# EAGLE design tridev (EAGLE 6.5.0)
AUTHOR: Brad Campbell; REV: A; TITLE: TriDev

## Sheet 1 of 2
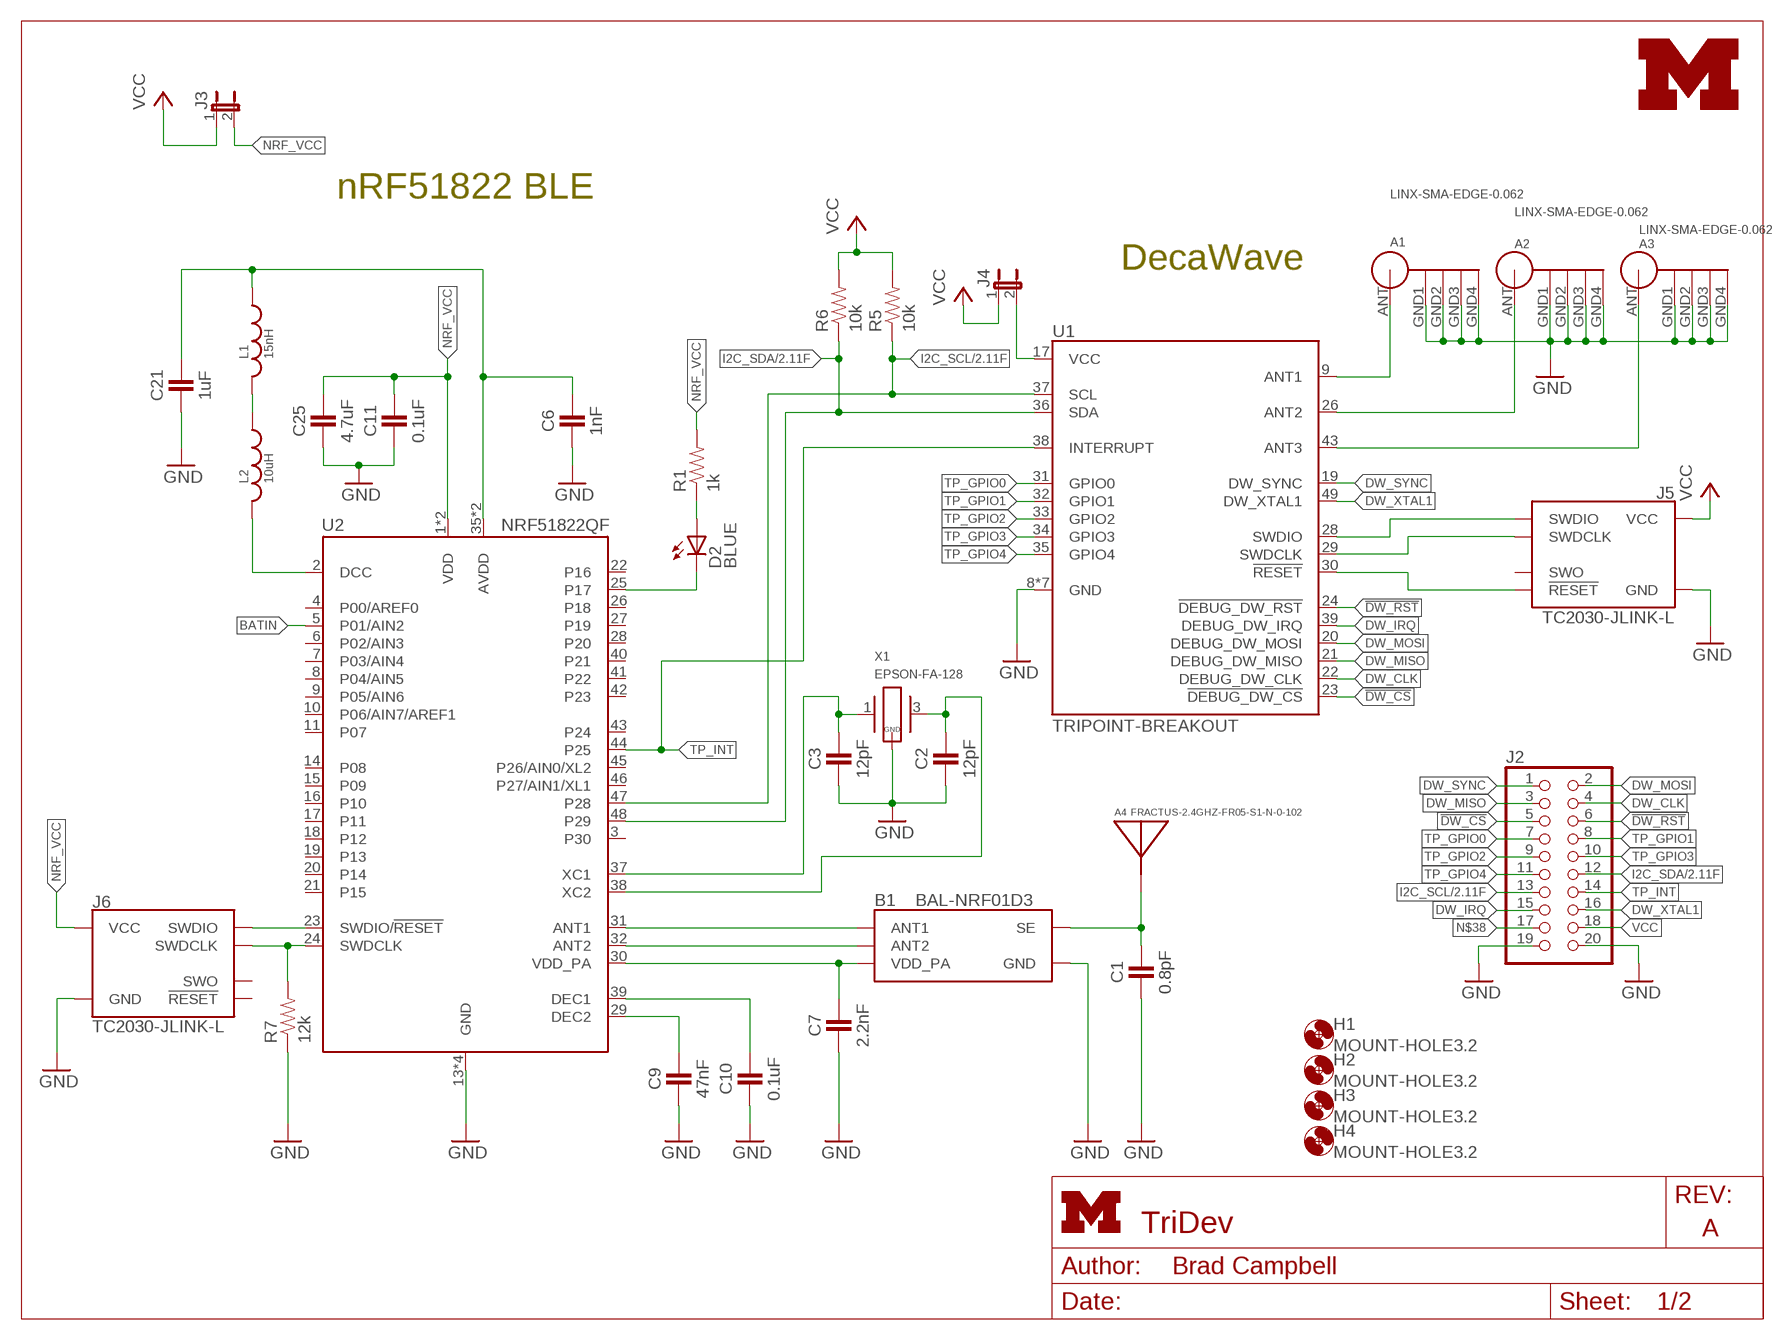
[diagram p0: schematic, sheet 1]
FRAME2 (LETTER_L): HEIGHT: 8.5in; WIDTH: 11in

### Parts
A1  LINX-SMA-EDGE-0.062  [CONSMA003.062]
A2  LINX-SMA-EDGE-0.062  [CONSMA003.062]
A3  LINX-SMA-EDGE-0.062  [CONSMA003.062]
A4  FRACTUS-2.4GHZ-FR05-S1-N-0-102  [FRACTUS-ANTENNA-FR05-S1-N-0-102]
B1  BAL-NRF01D3  [BAL-NRF01D3]
C1  0.8pF  CAPACITOR  [0402_CAP]
C2  12pF  CAPACITOR  [0402_CAP]
C3  12pF  CAPACITOR  [0402_CAP]
C6  1nF  CAPACITOR  [0402_CAP]
C7  2.2nF  CAPACITOR  [0402_CAP]
C9  47nF  CAPACITOR  [0402_CAP]
C10  0.1uF  CAPACITOR  [0402_CAP]
C11  0.1uF  CAPACITOR  [0402_CAP]
C21  1uF  CAPACITOR  [0402_CAP]
C25  4.7uF  CAPACITOR  [0402_CAP]
D2  BLUE  LED0603  [LED-0603]
H1  MOUNT-HOLE3.2  [3,2]
H2  MOUNT-HOLE3.2  [3,2]
H3  MOUNT-HOLE3.2  [3,2]
H4  MOUNT-HOLE3.2  [3,2]
J2  PINHD-2X10  [2X10]
J3  JUMPER-2PTH  [1X02]
J4  JUMPER-2PTH  [1X02]
J5  TC2030-JLINK-L  [TC2030-IDC]
J6  TC2030-JLINK-L  [TC2030-IDC]
L1  15nH  INDUCTOR0402  [0402_CAP]
L2  10uH  INDUCTOR0603  [0603_CAP]
LOGO1  UMICH_SOLID_SMALL  [UMICH_SOLID_75MIL]
R1  1k  RESISTOR0402_RES  [0402_RES]
R5  10k  RESISTOR0402_RES  [0402_RES]
R6  10k  RESISTOR0402_RES  [0402_RES]
R7  12k  RESISTOR0402_RES  [0402_RES]
U1  TRIPOINT-BREAKOUT  [TRIPOINT-BREAKOUT]
U2  NRF51822QF  [QFN-48-6MM]
X1  EPSON-FA-128  [FA-128]

### Nets
!CHRG1: D2.A R1.1
!DW_CS: J2.5 U1.23(!DEBUG_DW_CS)
!DW_RST: J2.6 U1.24(!DEBUG_DW_RST)
ANTENNA: A4.1(ANTENNA) B1.SE C1.1
AVDD: C6.1 C21.1 L1.1 U2.35(AVDD) U2.36(AVDD)
BATIN: U2.5(P01/AIN2)
DCC: L2.2 U2.2(DCC)
DW_CLK: J2.4 U1.22(DEBUG_DW_CLK)
DW_IRQ: J2.15 U1.39(DEBUG_DW_IRQ)
DW_MISO: J2.3 U1.21(DEBUG_DW_MISO)
DW_MOSI: J2.2 U1.20(DEBUG_DW_MOSI)
DW_SYNC: J2.1 U1.19(DW_SYNC)
DW_XTAL1: J2.16 U1.49(DW_XTAL1)
GND: A1.GND1 A1.GND2 A1.GND3 A1.GND4 A2.GND1 A2.GND2 A2.GND3 A2.GND4 A3.GND1 A3.GND2 A3.GND3 A3.GND4 B1.GND C1.2 C2.2 C3.2 C6.2 C7.2 C9.2 C10.2 C11.2 C21.2 C25.2 J2.19 J2.20 J5.5(GND) J6.5(GND) R7.1 U1.8(GND) U1.10(GND) U1.18(GND) U1.25(GND) U1.27(GND) U1.42(GND) U1.44(GND) U2.13(GND) U2.33(GND) U2.34(GND) U2.GND X1.2(GND) X1.4(GND) ; also sheet 2
I2C_SCL: J2.13 R5.1 U1.37(SCL) U2.47(P28) ; also sheet 2
I2C_SDA: J2.12 R6.1 U1.36(SDA) U2.48(P29) ; also sheet 2
N$1: A1.ANT U1.9(ANT1)
N$2: A2.ANT U1.26(ANT2)
N$3: A3.ANT U1.43(ANT3)
N$4: J5.2(SWDIO) U1.28(SWDIO)
N$6: D2.C U2.25(P17)
N$7: J5.4(SWDCLK) U1.29(SWDCLK)
N$8: J5.3(!RESET) U1.30(!RESET)
N$9: C3.1 U2.37(XC1) X1.1
N$10: C2.1 U2.38(XC2) X1.3
N$15: C9.1 U2.29(DEC2)
N$17: C10.1 U2.39(DEC1)
N$18: B1.ANT1 U2.31(ANT1)
N$19: B1.ANT2 U2.32(ANT2)
N$20: B1.VCC(VDD_PA) C7.1 U2.30(VDD_PA)
N$23: J4.2 U1.17(VCC)
N$37: L1.2 L2.1
N$38: J2.17
NRF_VCC: C11.1 C25.1 J3.2 J6.1(VCC) R1.2 U2.1(VDD) U2.12(VDD)
SWDCLK: J6.4(SWDCLK) R7.2 U2.24(SWDCLK)
SWDIO/!RESET: J6.2(SWDIO) U2.23(SWDIO/!RESET)
TP_GPIO0: J2.7 U1.31(GPIO0)
TP_GPIO1: J2.8 U1.32(GPIO1)
TP_GPIO2: J2.9 U1.33(GPIO2)
TP_GPIO3: J2.10 U1.34(GPIO3)
TP_GPIO4: J2.11 U1.35(GPIO4)
TP_INT: J2.14 U1.38(INTERRUPT) U2.44(P25)
VCC: J2.18 J3.1 J4.1 J5.1(VCC) R5.2 R6.2 ; also sheet 2
Unconnected: J5.6(SWO) J6.3(!RESET) J6.6(SWO) U2.3(P30) U2.4(P00/AREF0) U2.6(P02/AIN3) U2.7(P03/AIN4) U2.8(P04/AIN5) U2.9(P05/AIN6) U2.10(P06/AIN7/AREF1) U2.11(P07) U2.14(P08) U2.15(P09) U2.16(P10) U2.17(P11) U2.18(P12) U2.19(P13) U2.20(P14) U2.21(P15) U2.22(P16) U2.26(P18) U2.27(P19) U2.28(P20) U2.40(P21) U2.41(P22) U2.42(P23) U2.43(P24) U2.45(P26/AIN0/XL2) U2.46(P27/AIN1/XL1)

### Notes on the sheet
- nRF51822 BLE
- DecaWave

## Sheet 2 of 2
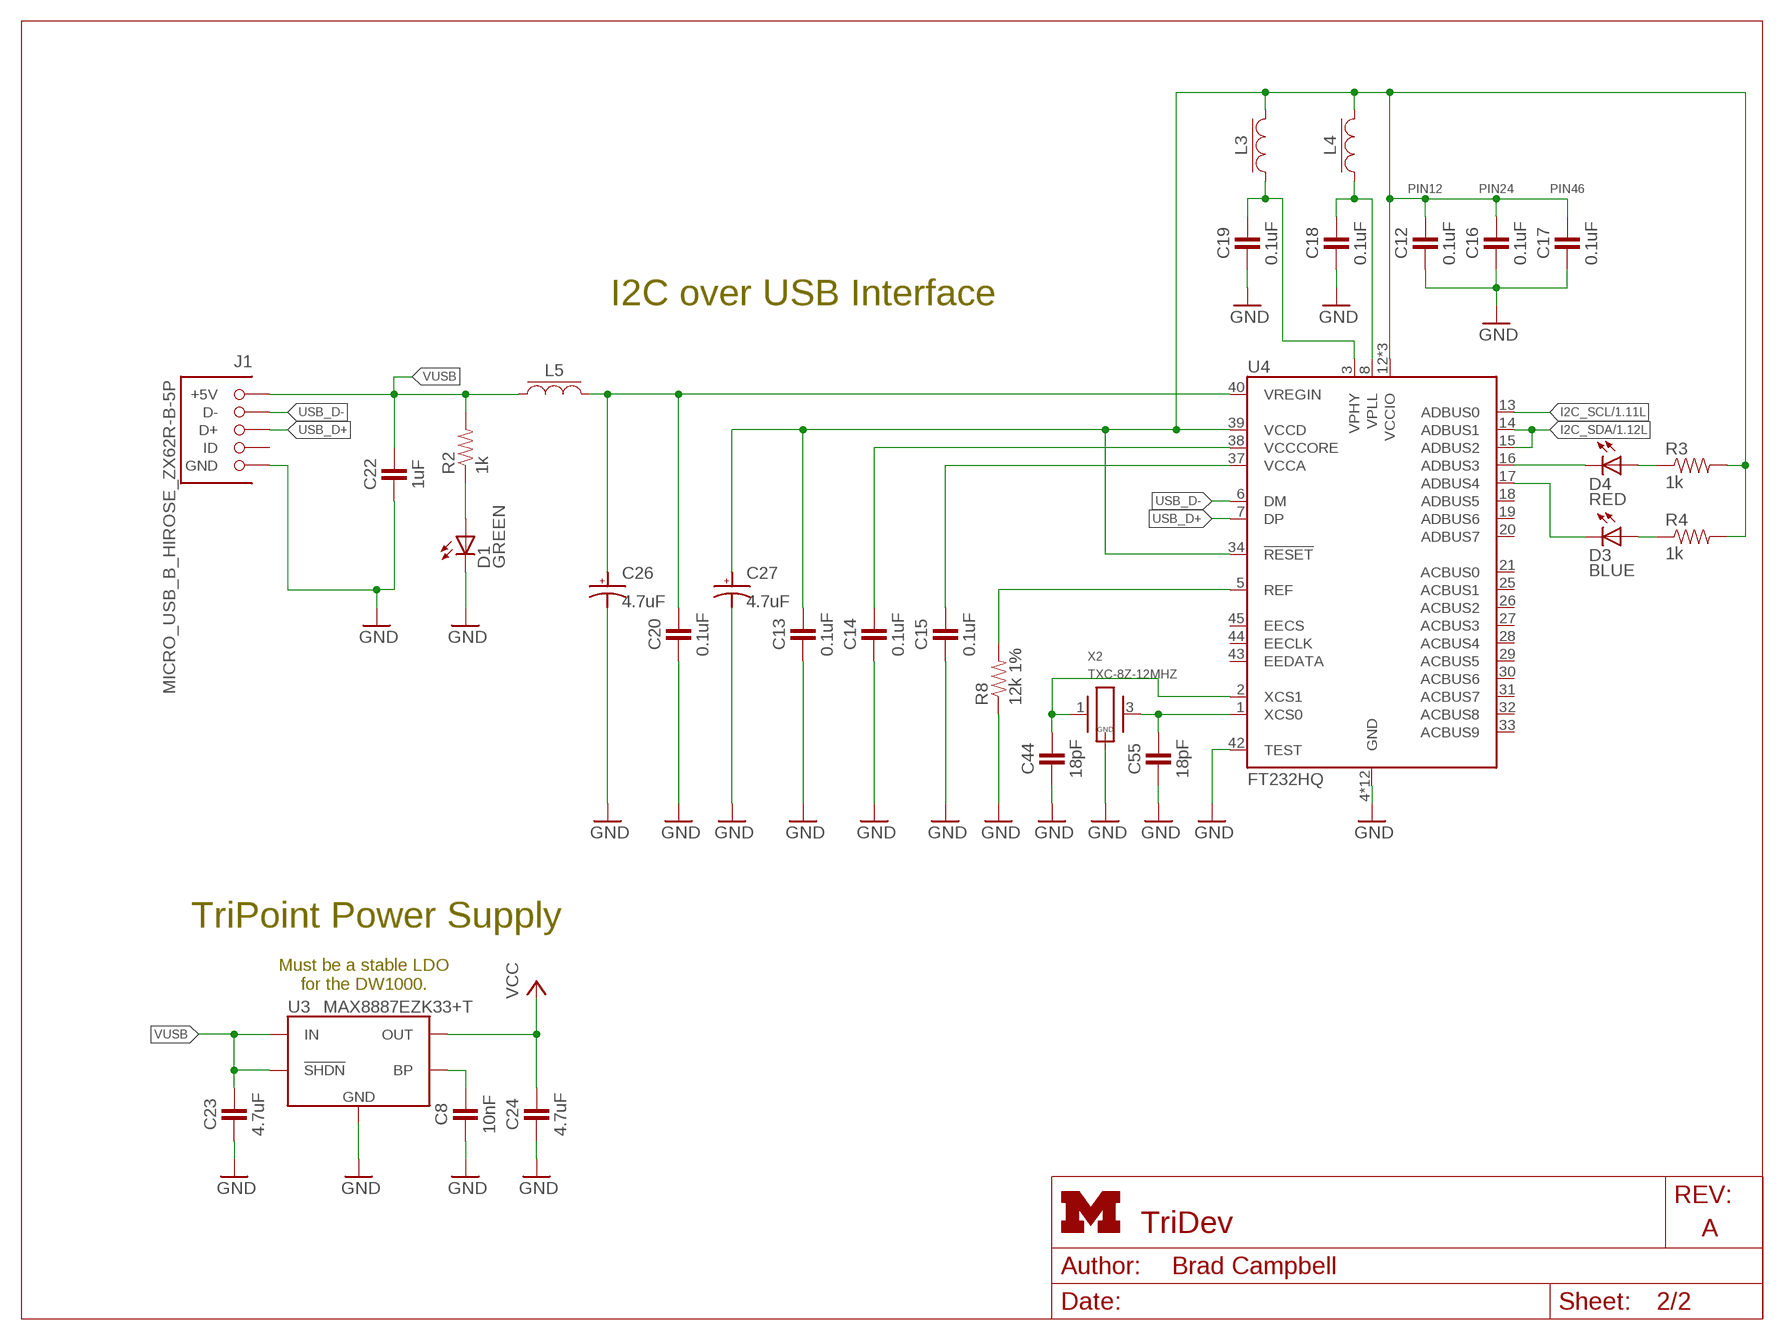
[diagram p1: schematic, sheet 2]
FRAME1 (LETTER_L): HEIGHT: 8.5in; WIDTH: 11in

### Parts
C8  10nF  CAPACITOR  [0402_CAP]
C12  0.1uF  CAPACITOR  [0402_CAP]
C13  0.1uF  CAPACITOR  [0402_CAP]
C14  0.1uF  CAPACITOR  [0402_CAP]
C15  0.1uF  CAPACITOR  [0402_CAP]
C16  0.1uF  CAPACITOR  [0402_CAP]
C17  0.1uF  CAPACITOR  [0402_CAP]
C18  0.1uF  CAPACITOR  [0402_CAP]
C19  0.1uF  CAPACITOR  [0402_CAP]
C20  0.1uF  CAPACITOR  [0402_CAP]
C22  1uF  CAPACITOR  [0402_CAP]
C23  4.7uF  CAPACITOR  [0402_CAP]
C24  4.7uF  CAPACITOR  [0402_CAP]
C26  4.7uF  CAP_POL0603  [CAP0603]
C27  4.7uF  CAP_POL0603  [CAP0603]
C44  18pF  CAPACITOR  [0402_CAP]
C55  18pF  CAPACITOR  [0402_CAP]
D1  GREEN  LED0603  [LED-0603]
D3  BLUE  LED0603  [LED-0603]
D4  RED  LED0603  [LED-0603]
J1  MICRO_USB_B_HIROSE_ZX62R-B-5P  [USB_MICRO_B-HIROSE-ZX62R-B-5P]
L3  FERRITE_BEAD  [0603_CAP]
L4  FERRITE_BEAD  [0603_CAP]
L5  FERRITE_BEAD  [0603_CAP]
R2  1k  RESISTOR0402_RES  [0402_RES]
R3  1k  RESISTOR0402_RES  [0402_RES]
R4  1k  RESISTOR0402_RES  [0402_RES]
R8  12k 1%  RESISTOR0402_RES  [0402_RES]
U3  MAX8887EZK33+T  [SOT-23-5]
U4  FT232HQ  [QFN-48-8MM]
X2  TXC-8Z-12MHZ  [TXC-8Z]

### Nets
!CHRG: D1.A R2.1
GND: C8.2 C12.2 C13.2 C14.2 C15.2 C16.2 C17.2 C18.2 C19.2 C20.2 C22.2 C23.2 C24.2 C26.NEG(ANODE) C27.NEG(ANODE) C44.2 C55.2 D1.C J1.5(GND) R8.1 U3.2(GND) U4.4(GND) U4.9(GND) U4.10(GND) U4.11(GND) U4.22(GND) U4.23(GND) U4.35(GND) U4.36(GND) U4.41(GND) U4.42(TEST) U4.47(GND) U4.48(GND) U4.PAD(GND) X2.2(GND) X2.4(GND) ; also sheet 1
I2C_SCL: U4.13(ADBUS0) ; also sheet 1
I2C_SDA: U4.14(ADBUS1) U4.15(ADBUS2) ; also sheet 1
N$5: D4.C U4.16(ADBUS3)
N$11: C8.1 U3.4(BP)
N$12: C20.1 C26.POS(CATHODE) L5.2 U4.40(VREGIN)
N$13: C14.1 U4.38(VCCCORE)
N$14: C55.1 U4.1(XCS0) X2.3
N$16: C44.1 U4.2(XCS1) X2.1
N$21: C15.1 U4.37(VCCA)
N$22: R8.2 U4.5(REF)
N$24: D4.A R3.1
N$25: D3.A R4.1
N$26: D3.C U4.17(ADBUS4)
USB_D+: J1.3(D+) U4.7(DP)
USB_D-: J1.2(D-) U4.6(DM)
VCC: C24.1 U3.5(OUT) ; also sheet 1
VCC3V3: C12.1 C13.1 C16.1 C17.1 C27.POS(CATHODE) L3.2 L4.2 R3.2 R4.2 U4.12(VCCIO) U4.24(VCCIO) U4.34(!RESET) U4.39(VCCD) U4.46(VCCIO)
VPHY: C19.1 L3.1 U4.3(VPHY)
VPLL: C18.1 L4.1 U4.8(VPLL)
VUSB: C22.1 C23.1 J1.1(+5V) L5.1 R2.2 U3.1(IN) U3.3(!SHDN)
Unconnected: J1.4(ID) U4.18(ADBUS5) U4.19(ADBUS6) U4.20(ADBUS7) U4.21(ACBUS0) U4.25(ACBUS1) U4.26(ACBUS2) U4.27(ACBUS3) U4.28(ACBUS4) U4.29(ACBUS5) U4.30(ACBUS6) U4.31(ACBUS7) U4.32(ACBUS8) U4.33(ACBUS9) U4.43(EEDATA) U4.44(EECLK) U4.45(EECS)

### Notes on the sheet
- PIN12 | PIN24 | PIN46
- I2C over USB Interface
- TriPoint Power Supply
- Must be a stable LDO
  for the DW1000.

## Library data of the parts
A1-A3 = connector:LINX-SMA-EDGE-0.062: CONN SMA JACK 50 OHM EDGE MNT; DIGIKEY: CONSMA003.062-ND
A4 = chips:FRACTUS-2.4GHZ-FR05-S1-N-0-102: Fractus Compact Reach XtendTM chip antenna is engineered specifically for Bluetooth, WLAN 802.11 b/g/n and other wireless devices operating at the ISM 2.4 GHz band. Compact Reach Xtend combines small form factor size and high performance to improve the functionality of your wireless devices.; RICHARDSON_RFPD: FR05-S1-N-0102B
B1 = chips:BAL-NRF01D3: 50 ohm nominal input / conjugate match balun to nRF51422-QFAA, nRF24LE1, nRF51822-QFAA/AB, with integrated harmonic filter; DIGIKEY: 497-13637-1-ND; MOUSER: 511-BAL-NRF01D3
C1-C3 C6-C25 C44 C55 = passives:CAPACITOR: 0402 Capacitor
C26 C27 = passives:CAP_POL; DIGIKEY: 478-8656-1-ND
D1-D4 = SparkFun-LED:LED: LEDs Standard schematic elements and footprints for 5mm, 3mm, 1206, and 0603 sized LEDs. 5mm - Spark Fun Electronics SKU : COM-00529 (and others)
H1-H4 = holes:MOUNT-HOLE: MOUNTING HOLE with drill center marker
J1 = connector:MICRO_USB_B_HIROSE_ZX62R-B-5P: USB Micro B Connector Rounded side is up.; DIGIKEY: H11574CT-ND; MOUSER: 798-ZX62R-B-5P; NEWARK: 69W0714
J2 = pinhead:PINHD-2X10: PIN HEADER
J3 J4 = SparkFun-Passives:JUMPER-2: Jumper Basic 0.1" spaced jumper. Use with breakaway headers.
J5 J6 = connector:TC2030-JLINK
L1 L2 = passives:INDUCTOR
L3-L5 = passives:FERRITE_BEAD; DIGIKEY: 445-2166-1-ND
LOGO1 = logos:UMICH_SOLID
R1-R8 = passives:RESISTOR: Resistor Basic schematic elements and footprints for 0603, 1206, and PTH resistors.
U1 = tripoint:TRIPOINT: UWB Ranging Module
U2 = chips:NRF51822: Multiprotocol Bluetooth® 4.0 low energy/2.4 GHz RF SoC; DIGIKEY: 1490-1032-1-ND; MOUSER: 949-NRF51822-QFAB-R7
U3 = chips:MAX8887: IC REG LDO 3.3V 0.3A TSOT23-5; DIGIKEY: MAX8887EZK33+TCT-ND
U4 = chips:FT232H: Single Channel USB to Multipurpose I/O IC; DIGIKEY: 768-1102-1-ND; MOUSER: 895-FT232HQ-REEL; NEWARK: 65W8039
X1 = crystals:EPSON-FA-128: MHz RANGE CRYSTAL UNIT ULTRA MINIATURE SIZE LOW PROFILE SMD http://www.digikey.com/product-search/en?FV=ffec63d1
X2 = crystals:TXC-8Z; DIGIKEY: 887-1487-1-ND

## Board
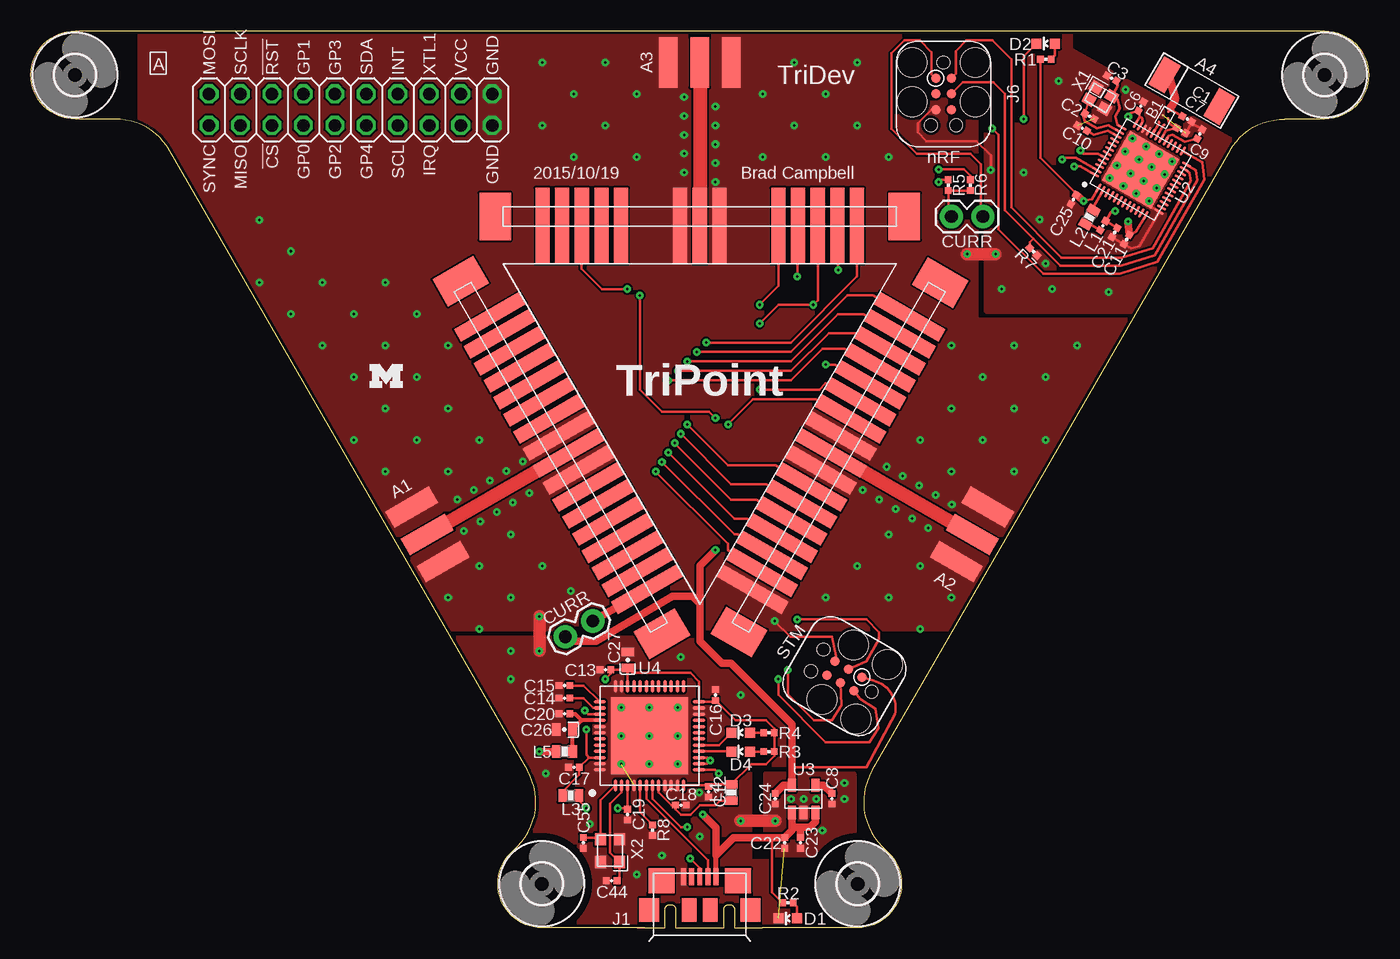
[diagram p2: board, top side]
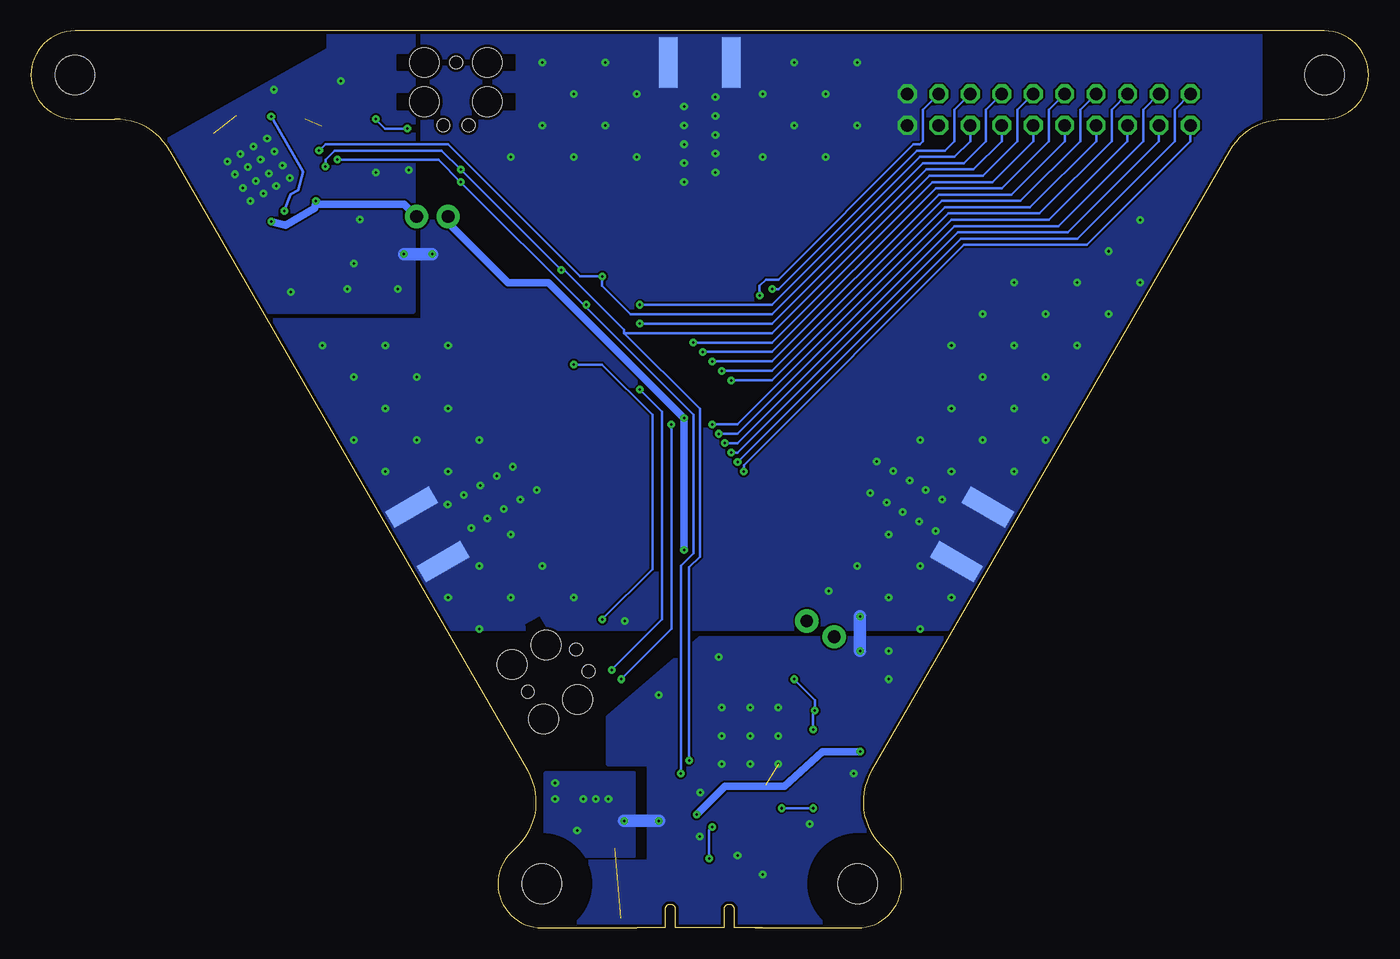
[diagram p3: board, bottom side, seen from below]

Size 108 x 72.39 mm. Coordinates in mm from the lower left corner, seen from the top.
Outline: 49.56,0 41.25,0 arc-140 38.96,6.27 arc80 40.08,12.7 11.2,62.74 arc60 6.78,65.28 3.56,65.28 arc-180 3.56,72.39 104.44,72.39 arc-180 104.44,65.28 101.22,65.28 arc60 96.8,62.74 67.92,12.7 arc80 69.04,6.27 arc-140 66.75,0 59.08,0
Copper layers (1*16): Top 0.0178mm / dielectric 59mil / Bottom 0.0178mm
Design rules "sunstone-2lyr_v1.0.0.3 *": minimum track width 6mil, minimum drill 14mil, track to track 6mil, track to pad 6mil, pad to pad 6mil, via to via 6mil, smd to smd 6mil, copper to edge 10mil, drill to drill 16mil, minimum pad ring 8mil, minimum via ring 8mil, stop-mask expansion 3mil, vias tented up to drill 50mil, thermal gap 10mil

### Footprints (pad centres in the part's own frame; a part is rotated, then mirrored left to right if it is on the bottom)
CONSMA003.062 = smd 4.06 x 1.52: ANT 0,0; GND1 0,2.54; GND2 0,-2.54 | smd 4.06 x 1.52 bottom: GND3 0,2.54; GND4 0,-2.54
FRACTUS-ANTENNA-FR05-S1-N-0-102 = smd 1.5 x 2.6: 1 -2.55,0; 2 2.55,0
BAL-NRF01D3 = smd 0.22 x 0.22: ANT1 -0.537,-0.25; ANT2 -0.537,0.25; GND 0.069,0.25; SE 0.537,0; VCC 0.069,-0.25
0402_CAP = smd 0.536 x 0.546: 1 -0.433,0; 2 0.433,0
CAP0603 = smd 0.7 x 1: NEG 0.65,0; POS -0.65,0
LED-0603 = smd 0.8 x 0.8: A 0,-0.75; C 0,0.75
3,2 = hole 3.2: 0,0
USB_MICRO_B-HIROSE-ZX62R-B-5P = smd 0.4 x 1.35: 1 1.3,4.125; 2 0.65,4.125; 3 0,4.125; 4 -0.65,4.125; 5 -1.3,4.125 | smd 2.1 x 2: P$1 3.1,3.8; P$2 -3.1,3.8 | smd 1.6 x 1.9: P$3 -4.1,1.45; P$6 4.1,1.45 | smd 1.2 x 1.9: P$4 -0.85,1.45; P$5 0.85,1.45
2X10 = drill 1.016 octagon: 1 -11.43,-1.27; 2 -11.43,1.27; 3 -8.89,-1.27; 4 -8.89,1.27; 5 -6.35,-1.27; 6 -6.35,1.27; 7 -3.81,-1.27; 8 -3.81,1.27; 9 -1.27,-1.27; 10 -1.27,1.27; 11 1.27,-1.27; 12 1.27,1.27; 13 3.81,-1.27; 14 3.81,1.27; 15 6.35,-1.27; 16 6.35,1.27; 17 8.89,-1.27; 18 8.89,1.27; 19 11.43,-1.27; 20 11.43,1.27
1X02 = drill 1.016 pad 1.88: 1 0,0; 2 2.54,0
TC2030-IDC = smd 0.787 x 0.787: 1 -1.27,-0.635; 2 -1.27,0.635; 3 0,-0.635; 4 0,0.635; 5 1.27,-0.635; 6 1.27,0.635 | hole 2.375: -2.54,2.54; 0.635,2.54; 0.635,-2.54; -2.54,-2.54 | hole 1.016: -2.54,0; 2.54,1.016; 2.54,-1.016
0603_CAP = smd 0.7 x 1: 1 -0.65,0; 2 0.65,0
0402_RES = smd 0.536 x 0.546: 1 -0.433,0; 2 0.433,0
TRIPOINT-BREAKOUT = smd 1.143 x 6.096 rotated 120: 1 -16.929,4.89; 2 -16.135,3.515; 3 -15.342,2.14; 4 -14.548,0.765; 5 -13.754,-0.61; 6 -12.96,-1.985; 7 -12.167,-3.359; 8 -11.373,-4.734; 9 -10.579,-6.109; 10 -9.785,-7.484; 11 -8.992,-8.859; 12 -8.198,-10.234; 13 -7.404,-11.609; 14 -6.61,-12.984; 15 -5.817,-14.359; 16 -5.023,-15.734; 17 -4.229,-17.108 | smd 1.143 x 6.096 rotated 60: 18 4.229,-17.108; 19 5.023,-15.734; 20 5.817,-14.359; 21 6.61,-12.984; 22 7.404,-11.609; 23 8.198,-10.234; 24 8.992,-8.859; 25 9.785,-7.484; 26 10.579,-6.109; 27 11.373,-4.734; 28 12.167,-3.359; 29 12.96,-1.985; 30 13.754,-0.61; 31 14.548,0.765; 32 15.342,2.14; 33 16.135,3.515; 34 16.929,4.89 | smd 1.143 x 6.096: 35 12.7,12.222; 36 11.113,12.222; 37 9.525,12.222; 38 7.938,12.222; 39 6.35,12.222; 42 1.587,12.222; 43 0,12.222; 44 -1.587,12.222; 47 -6.35,12.222; 48 -7.938,12.222; 49 -9.525,12.222; 50 -11.113,12.222; 51 -12.7,12.222 | smd 2.54 x 3.81: SOLDERPAD1 -16.51,12.959; SOLDERPAD2 16.51,12.959 | smd 2.54 x 3.81 rotated 60: SOLDERPAD3 19.426,7.62; SOLDERPAD4 3.17,-20.574 | smd 2.54 x 3.81 rotated 120: SOLDERPAD5 -3.048,-20.706; SOLDERPAD6 -19.304,7.742
QFN-48-6MM = smd 0.8 x 0.203: 1 -3,2.2; 2 -3,1.8; 3 -3,1.4; 4 -3,1; 5 -3,0.6; 6 -3,0.2; 7 -3,-0.2; 8 -3,-0.6; 9 -3,-1; 10 -3,-1.4; 11 -3,-1.8; 12 -3,-2.2; 25 3,-2.2; 26 3,-1.8; 27 3,-1.4; 28 3,-1; 29 3,-0.6; 30 3,-0.2; 31 3,0.2; 32 3,0.6; 33 3,1; 34 3,1.4; 35 3,1.8; 36 3,2.2 | smd 0.203 x 0.8: 13 -2.2,-3; 14 -1.8,-3; 15 -1.4,-3; 16 -1,-3; 17 -0.6,-3; 18 -0.2,-3; 19 0.2,-3; 20 0.6,-3; 21 1,-3; 22 1.4,-3; 23 1.8,-3; 24 2.2,-3; 37 2.2,3; 38 1.8,3; 39 1.4,3; 40 1,3; 41 0.6,3; 42 0.2,3; 43 -0.2,3; 44 -0.6,3; 45 -1,3; 46 -1.4,3; 47 -1.8,3; 48 -2.2,3 | smd 4.6 x 4.6: GND 0,0
SOT-23-5 = smd 0.65 x 1.06: 1 -0.95,-1.1; 2 0,-1.1; 3 0.95,-1.1; 4 0.95,1.1; 5 -0.95,1.1
QFN-48-8MM = smd 0.3 x 1: 1 -2.75,-4; 2 -2.25,-4; 3 -1.75,-4; 4 -1.25,-4; 5 -0.75,-4; 6 -0.25,-4; 7 0.25,-4; 8 0.75,-4; 9 1.25,-4; 10 1.75,-4; 11 2.25,-4; 12 2.75,-4; 25 2.75,4; 26 2.25,4; 27 1.75,4; 28 1.25,4; 29 0.75,4; 30 0.25,4; 31 -0.25,4; 32 -0.75,4; 33 -1.25,4; 34 -1.75,4; 35 -2.25,4; 36 -2.75,4 | smd 1 x 0.3: 13 4,-2.75; 14 4,-2.25; 15 4,-1.75; 16 4,-1.25; 17 4,-0.75; 18 4,-0.25; 19 4,0.25; 20 4,0.75; 21 4,1.25; 22 4,1.75; 23 4,2.25; 24 4,2.75; 37 -4,2.75; 38 -4,2.25; 39 -4,1.75; 40 -4,1.25; 41 -4,0.75; 42 -4,0.25; 43 -4,-0.25; 44 -4,-0.75; 45 -4,-1.25; 46 -4,-1.75; 47 -4,-2.25; 48 -4,-2.75 | smd 6.2 x 6.2: PAD 0,0
FA-128 = smd 0.95 x 0.85: 1 -0.725,-0.575; 2 0.725,-0.575; 3 0.725,0.575; 4 -0.725,0.575
TXC-8Z = smd 1 x 0.9: 1 -0.925,-0.775; 2 0.925,-0.775; 3 0.925,0.775; 4 -0.925,0.775

### Placement (x,y rotation side)
A1  32,31.75 30 top
A2  76,31.75 150 top
A3  54,69.85 90 top
A4  93.74,67.58 330 top
B1  91.56,65.4 60 top
C1  93.36,65.29 330 top
C2  85.48,65.52 330 top
C3  87.26,68.57 150 top
C6  89.62,66.31 60 top
C7  92.87,64.35 330 top
C8  64.67,10.41 270 top
C9  94.37,64.07 60 top
C10  84.89,64.54 150 top
C11  88.47,55.56 240 top
C12  54.7,10.98 270 top
C13  46.38,20.83 180 top
C14  43.08,18.54 180 top
C15  43.08,19.56 180 top
C16  55.27,18.8 90 top
C17  43.84,12.95 180 top
C18  52.48,9.91 0 top
C19  48.16,9.14 270 top
C20  43.08,17.27 180 top
C21  87.5,56.12 240 top
C22  60.86,6.86 270 top
C23  62.13,6.86 270 top
C24  60.1,10.41 270 top
C25  84.18,58.79 240 top
C26  43.08,16 180 top
C27  48.18,21.62 90 top
C44  46.89,3.81 180 top
C55  44.6,6.86 270 top
D1  61.11,0.76 90 top
D2  81.94,71.37 90 top
D3  57.3,15.75 90 top
D4  57.3,14.22 90 top
H1  41.25,3.56 0 top
H2  3.56,68.83 0 top
H3  104.44,68.83 0 top
H4  66.75,3.56 0 top
J1  54,0 0 top
J2  25.81,66.04 0 top
J3  74.32,57.4 0 top
J4  43.15,23.5 30 top
J5  65.68,20.32 150 top
J6  73.69,67.31 270 top
L1  86.56,56.68 240 top
L2  85.47,57.36 60 top
L3  43.59,10.67 180 top
L4  56.54,10.92 90 top
L5  43.08,14.22 0 top
LOGO1  27.33,43.59 0 top
R1  81.94,70.1 180 top
R2  61.11,2.03 180 top
R3  59.59,14.22 0 top
R4  59.59,15.75 0 top
R5  74.07,59.94 270 top
R6  75.84,59.94 270 top
R7  80.95,54.58 135 top
R8  50.19,7.87 90 top
U1  54,44.45 0 top
U2  89.6,61.2 60 top
U3  62.38,10.41 0 top
U4  49.94,15.49 0 top
X1  86.34,66.99 150 top
X2  46.75,6.23 90 top

### Tracks (layer width: path | path; a pad name or v marks a point on that pad's centre or on a via)
!CHRG
  Top 0.203: D1.A 61.86,1.72 R2.1
!CHRG1
  Top 0.203: D2.A 82.69,70.42 R1.1
!DW_CS  (via drill 0.2)
  Top 0.203: v52.48,39.88 56.54,35.81 59.33,35.81 U1.23
  Bottom 0.203: J2.5 19.46,63.5 25.81,57.15 33.68,57.15 50.95,39.88 v52.48,39.88
!DW_RST  (via drill 0.2)
  Top 0.203: v52.98,40.64 56.29,37.34 60.1,37.34 U1.24
  Bottom 0.203: J2.6 20.73,66.04 20.73,63.5 26.57,57.66 33.93,57.66 50.95,40.64 v52.98,40.64
ANTENNA
  Top 0.203: C1.1 92.19,65.96 92.15,65.98 92.07,66.29 | 92.01,66.18 B1.SE
  Top 0.635: A4.1 91.91,68.63 92.39,66.84 92.07,66.29 92.01,66.18
AVDD  (via drill 0.2)
  Top 0.203: U2.36 89.53,65.48 | 89.53,65.48 C6.1 88.76,65.76 v88.61,65.49 | U2.35 89.78,65.12 89.71,65.37 89.53,65.48 | C21.1 L1.1 87.19,57.77 v87.54,57.87
  Bottom 0.203: v88.61,65.49 86.04,61.04 86.44,59.54 87.02,59.21 v87.54,57.87
DCC
  Top 0.203: U2.2 85.97,58.51 85.79,58.21 L2.2
DW_CLK  (via drill 0.2)
  Top 0.203: v51.97,39.12 56.54,34.54 58.57,34.54 U1.22
  Bottom 0.203: J2.4 18.19,66.04 18.19,63.5 25.04,56.64 33.43,56.64 50.95,39.12 v51.97,39.12
DW_IRQ  (via drill 0.2)
  Top 0.203: v58.83,50.29 60.35,51.82 U1.39
  Bottom 0.203: J2.15 32.16,63.5 33.43,62.23 36.22,62.23 48.16,50.29 v58.83,50.29
DW_MISO  (via drill 0.2)
  Top 0.203: v51.46,38.35 56.79,33.02 57.81,33.02 U1.21
  Bottom 0.203: J2.3 16.92,63.5 24.28,56.13 33.17,56.13 50.95,38.35 v51.46,38.35
DW_MOSI  (via drill 0.2)
  Top 0.203: v50.95,37.59 56.79,31.75 57.05,31.75 U1.20
  Bottom 0.203: J2.2 15.65,66.04 15.65,63.5 23.52,55.63 32.92,55.63 v50.95,37.59
DW_SYNC  (via drill 0.2)
  Top 0.203: v50.44,36.83 56.29,30.99 56.29,30.48 U1.19
  Bottom 0.203: J2.1 14.38,63.5 22.76,55.12 32.66,55.12 50.44,37.34 v50.44,36.83
DW_XTAL1  (via drill 0.2)
  Top 0.203: v48.16,51.56 46.13,51.56 44.48,53.21 U1.49
  Bottom 0.203: J2.16 33.43,66.04 33.43,63.5 34.19,62.74 36.47,62.74 47.65,51.56 v48.16,51.56
GND  (via drill 0.2)  (4 unrouted)
  Top 0.203: C7.2 93.75,65 C1.2 93.77,64.92 C9.2 | v90.28,58.66 90.41,58.19 U2.13 89.49,55.02 88.84,54.84 C11.2 C21.2 | J6.5 72.69,66.04 71.6,64.95 71.6,64.21 72.31,63.5 76.35,63.5 77.5,62.35 v77.5,61.16 | J5.5 65,21.97 64.69,23.5 61.32,23.5 v60.05,24.77
  Top 1.016: v77.88,54.37 75.59,54.36 | v41.05,25.15 v41.05,22.35 | v57.3,8.64 v60.1,8.64
  Bottom 1.016: v75.59,54.37 v77.88,54.37 | v41.05,22.35 v41.05,25.15 | v60.1,8.64 v57.3,8.64
  other vias: 87.08,60.51 87.68,61.55 88.93,63.71 88.33,62.67 89.46,62.02 90.88,59.7 89.85,60.3 89.25,59.26 88.81,60.9 88.2,59.87 90.06,63.06 91.1,62.46 90.5,61.42 92.13,61.86 91.53,60.82 88.39,67.65 61.37,10.41 62.38,10.41 63.4,10.41 47.65,13.21 49.94,13.21 52.22,13.21 52.22,15.49 52.22,17.78 49.94,15.49 49.94,17.78 47.65,17.78 47.65,15.49 50.95,5.84 57.3,18.8 52.48,21.84 38.76,22.35 38.76,20.07 41.55,12.45 53.98,10.92 45.11,8.38 65.68,11.68 63.91,7.87 81.94,53.61 65.68,10.41 82.96,68.34 78.39,51.58 82.45,51.58 87.02,51.33 81.44,57.17 80.17,60.98 52.73,67.06 55.27,66.29 52.73,65.53 52.73,64.01 52.73,62.48 52.73,60.96 55.27,64.77 55.27,63.25 55.27,61.72 55.27,60.2 36.22,39.37 31.14,39.37 26.06,39.37 28.6,41.91 33.68,41.91 28.6,36.83 26.06,44.45 31.14,44.45 33.68,46.99 31.14,49.53 28.6,46.99 26.06,49.53 23.52,46.99 23.52,52.07 20.98,49.53 28.6,52.07 33.68,36.83 20.98,54.61 18.44,52.07 18.44,57.15 38.76,31.75 36.22,29.21 41.3,29.21 38.76,26.67 36.22,24.13 33.68,26.67 43.59,27.2 69.24,31.75 71.78,29.21 66.7,29.21 69.24,26.67 74.32,26.67 64.16,26.67 71.78,24.13 71.78,39.37 76.86,39.37 74.32,36.83 74.32,41.91 79.4,41.91 79.4,36.83 76.86,44.45 74.32,46.99 81.94,39.37 81.94,44.45 79.4,46.99 84.48,46.99 59.08,67.31 59.08,62.23 48.92,62.23 48.92,67.31 46.38,64.77 43.84,62.23 41.3,64.77 43.84,67.31 41.3,69.85 46.38,69.85 61.62,64.77 64.16,62.23 66.7,64.77 64.16,67.31 61.62,69.85 66.7,69.85 69.24,62.23 54,7.37 48.92,4.32 69.08,37.22 70.4,36.45 71.72,35.69 73.04,34.93 74.36,34.17 67.17,35.34 68.49,34.57 69.81,33.81 71.13,33.05 72.45,32.29 39.71,37.63 38.39,36.86 37.07,36.1 35.75,35.34 34.43,34.58 40.24,35.09 38.92,34.32 37.6,33.56 36.28,32.8 34.96,32.04
  pour Top (no thermals): 31.65,0 66.45,0 66.45,5.33 58.06,5.33 58.06,13.21 61.37,13.21 61.37,17.02 54,23.37 31.65,23.37
  pour Top (no thermals): 59.33,12.45 66.45,12.45 66.45,5.84 59.33,5.84
  pour Top (no thermals): 83.97,73.15 77.11,73.15 77.11,49.78 98.7,49.78 98.7,62.59 83.97,70.89
  pour Top (no thermals): 8.79,24.13 89.05,24.13 89.05,49.02 76.35,49.02 76.35,73.15 8.79,73.15
  pour Bottom (no thermals): 31.65,23.37 31.65,0 66.45,0 66.45,5.33 58.06,5.33 58.06,13.21 61.37,13.21 61.37,17.02 54,23.37
  pour Bottom (no thermals): 59.33,12.45 66.45,12.45 66.45,5.84 59.33,5.84
  pour Bottom (no thermals): 77.11,73.15 83.97,73.15 83.97,70.89 98.7,62.59 98.7,49.78 77.11,49.78
  pour Bottom (no thermals): 76.35,73.15 8.79,73.15 8.79,24.13 89.05,24.13 89.05,49.02 76.35,49.02
I2C_SCL  (via drill 0.2)
  Top 0.203: U4.13 55.23,12.74 v55.52,12.45 | 63.4,56.55 U1.37 63.53,50.67 v63.14,50.29 60.35,50.29 v58.83,48.77 | U2.47 84.38,62.15 83.41,62.15 v83.26,62 | R5.1 73.48,60.38 v73.3,60.2
  Bottom 0.203: v83.26,62 75.08,61.98 v73.3,60.2 63.4,50.29 v63.14,50.29 63.14,50.04 54.51,41.4 54.51,30.23 55.52,29.21 v55.52,12.45 | J2.13 29.62,63.5 31.9,61.21 35.71,61.21 48.16,48.77 v58.83,48.77
I2C_SDA  (via drill 0.2)
  Top 0.203: U4.14 54.6,13.24 v54.86,13.51 54.63,13.74 U4.15 | v65.18,53.09 65.18,56.61 U1.36 | U2.48 84.73,61.47 v84.23,61.47 | R6.1 75.84,60.71 75.34,61.21 v73.3,61.21
  Bottom 0.203: 60.1,48.01 54,41.91 54,29.97 54.86,29.11 v54.86,13.51 | v84.23,61.47 84.23,61.98 83.46,62.74 74.83,62.74 v73.3,61.21 v65.18,53.09 64.92,53.09 60.1,48.26 60.1,48.01 | J2.12 28.35,66.04 28.35,63.5 31.14,60.71 35.46,60.71 48.16,48.01 60.1,48.01
N$1
  Top 1.113: A1.ANT U1.9
N$2
  Top 1.113: U1.26 A2.ANT
N$3
  Top 1.113: A3.ANT U1.43
N$4  (via drill 0.2)
  Top 0.203: v60.35,20.07 60.35,18.8 64.16,14.99 67.72,14.99 68.43,16.1 68.17,17.68 66.95,18.49 J5.2 | U1.28 63.4,42.67 58.32,42.67 v56.29,40.64
  Bottom 0.203: v60.35,20.07 56.29,24.13 v56.29,40.64
N$5
  Top 0.203: U4.16 56.53,14.24 D4.C
N$6  (via drill 0.2)
  Top 0.203: U2.25 94.56,61.8 94.74,60.38 90.93,53.77 87.93,52.78 81.74,52.78 78.13,56.39 78.13,64.01 v77.62,64.52 | v80.16,65.28 80.16,70.35 D2.C
  Bottom 0.203: v77.62,64.52 79.4,64.52 v80.16,65.28
N$7  (via drill 0.2)
  Top 0.203: J5.4 65.43,17.98 64.67,16.76 63.22,16.76 61.11,18.87 v61.11,20.83 | v58.83,43.43 63.65,43.43 64.16,43.94 U1.29
  Bottom 0.203: v61.11,20.83 57.05,24.89 57.05,41.66 v58.83,43.43
N$8  (via drill 0.2)
  Top 0.203: J5.3 67.46,21.51 68.48,23.29 68.48,23.88 67.46,24.89 v61.87,24.89 | v64.16,45.47 64.92,45.47 U1.30
  Bottom 0.203: v61.87,24.89 57.81,28.96 57.81,41.4 61.87,45.47 v64.16,45.47
N$9
  Top 0.203: U2.37 87.73,64.82 87.55,65.52 87.9,66.14 87.71,66.87 X1.1 87.74,67.96 C3.1
N$10
  Top 0.152: X1.3 C2.1
  Top 0.203: U2.38 86.98,64.79 86.05,64.54 85.08,65.09 84.97,65.5 C2.1
N$11
  Top 0.61: C8.1 64,11.51 U3.4
N$12
  Top 0.305: U4.40 44.47,16.74 | 44.47,16.74 C26.POS L5.2 | C20.1 43.94,17.27 44.47,16.74
N$13
  Top 0.203: C14.1 44.6,18.54 45.36,17.78 45.9,17.78 U4.38
N$14
  Top 0.203: U4.1 45.98,10.29 X2.3 45.84,7.29 C55.1
N$15
  Top 0.203: U2.29 91.87,63.94 92.15,64.02 93.17,63.43 C9.1
N$16
  Top 0.203: U4.2 47.69,10.96 46.76,10.03 46.76,6.07 X2.1 47.53,4.14 C44.1
N$17
  Top 0.203: C10.1 85.82,64 86.97,64.34 U2.39
N$18
  Top 0.203: U2.31 91.44,64.79 B1.ANT1
N$19
  Top 0.203: U2.32 91.09,64.99 B1.ANT2
N$20
  Top 0.203: U2.30 91.64,64.34 C7.1 91.93,64.9 B1.VCC
N$21
  Top 0.203: U4.37 44.62,19.56 C15.1
N$22
  Top 0.203: 49.17,11.48 U4.5 49.19,9.31 R8.2
N$23
  Top 0.61: J4.2 U1.17
N$24
  Top 0.203: D4.A R3.1
N$25
  Top 0.203: D3.A R4.1
N$26
  Top 0.203: U4.17 55.55,14.74 D3.C
N$37
  Top 0.203: L1.2 85.37,56.86 L2.1
NRF_VCC  (via drill 0.2)
  Top 0.203: U2.1 85.67,58.83 v84.99,58.67 81.51,62.16 R1.2 | U2.12 89.23,56.19 C11.1 | J6.1 72.72,68.91 72.72,70.69 71.78,71.63 70.51,71.63 69.49,70.61 69.49,64.52 71.53,62.48 75.84,62.48 76.68,61.65 76.68,57.58 J3.2
  Top 0.61: C25.1 v84.99,58.67 | v88.57,57 C11.1
  Bottom 0.61: J3.2 77.88,58.42 84.73,58.42 v84.99,58.67 85.12,58.06 87.43,56.69 v88.57,57
SWDCLK
  Top 0.203: U2.24 94.06,61.16 94.18,60.33 90.73,54.31 87.99,53.44 83.11,53.44 80.92,55.63 | 80.92,55.63 78.64,57.91 78.64,67.31 77.7,68.25 75.26,68.25 J6.4 | R7.2 80.64,55.34 80.92,55.63
SWDIO/!RESET
  Top 0.203: U2.23 93.55,60.96 93.65,60.3 90.58,54.86 88.04,54.1 83.21,54.1 79.15,58.17 79.15,70.1 77.62,71.63 75.54,71.63 74.68,70.76 74.68,68.94 J6.2
TP_GPIO0  (via drill 0.2)
  Top 0.203: v51.46,44.2 61.37,44.2 63.91,46.74 65.68,46.74 U1.31
  Bottom 0.203: J2.7 22,63.5 27.33,58.17 34.19,58.17 48.16,44.2 v51.46,44.2
TP_GPIO1  (via drill 0.2)
  Top 0.203: U1.32 66.7,48.01 64.41,48.01 61.37,44.96 v52.22,44.96
  Bottom 0.203: J2.8 23.27,66.04 23.27,63.5 28.09,58.67 34.44,58.67 48.16,44.96 v52.22,44.96
TP_GPIO2  (via drill 0.2)
  Top 0.203: U1.33 67.21,49.53 65.18,49.53 61.37,45.72 v52.98,45.72
  Bottom 0.203: J2.9 24.54,63.5 28.85,59.18 34.7,59.18 48.16,45.72 v52.98,45.72
TP_GPIO3  (via drill 0.2)
  Top 0.203: U1.34 67.97,51.05 65.94,51.05 61.37,46.48 v53.75,46.48
  Bottom 0.203: J2.10 25.81,66.04 25.81,63.5 29.62,59.69 34.95,59.69 48.16,46.48 v53.75,46.48
TP_GPIO4  (via drill 0.2)
  Top 0.203: v54.51,47.24 61.37,47.24 66.7,52.58 U1.35
  Bottom 0.203: J2.11 27.08,63.5 30.38,60.2 35.2,60.2 48.16,47.24 v54.51,47.24
TP_INT  (via drill 0.2)
  Top 0.203: U1.38 61.87,56.61 v61.87,52.58 | v84.73,62.74 84.99,62.48 86.13,62.48 U2.44
  Bottom 0.203: v84.73,62.74 84.23,63.25 74.32,63.25 63.65,52.58 v61.87,52.58 61.87,51.82 59.59,49.53 48.16,49.53 35.97,61.72 32.66,61.72 30.89,63.5 30.89,66.04 J2.14
USB_D+  (via drill 0.2)
  Top 0.203: J1.3 54,4.83 v53.24,5.59 | v52.98,8.13 52.48,8.13 50.19,10.42 U4.7
  Bottom 0.203: v53.24,5.59 53.24,7.87 v52.98,8.13
USB_D-
  Top 0.203: U4.6 49.69,10.41 54.65,5.45 J1.2
VCC  (via drill 0.2)
  Top 0.203: 61.43,12.95 67.46,12.95 69.75,17.25 arc90 68.08,19.93 J5.1 | v49.17,51.05 49.17,43.43 50.95,41.66 54.76,41.66 v55.27,41.15 | R6.2 R5.2 74.07,57.66 J3.1
  Top 0.61: C24.1 60.76,11.51 U3.5 61.43,12.95 61.43,16.44 56.54,21.34 55.78,21.34 54,23.11 54,26.16 | 54,26.16 54,29.21 v55.27,30.48 | J4.1 43.54,23.11 45.62,23.11 51.79,26.75 53.42,26.75 54,26.16
  Bottom 0.203: J2.18 35.97,66.04 35.97,63.5 36.22,63.25 36.73,63.25 47.65,52.32 48.67,52.32 49.17,51.82 v49.17,51.05
  Bottom 0.61: v55.27,30.48 v55.27,41.15 66.19,52.07 69.49,52.07 74.32,56.9 J3.1
VCC3V3  (via drill 0.2)
  Top 0.203: U4.12 54.7,11.49 54.76,11.43 54.72,11.43 C12.1 54.86,11.57 L4.2 58.18,13.21 59.33,13.21 60.02,13.9 R3.2 R4.2 60.02,16.08 59.33,16.76 56.87,16.76 C16.1 55.15,18.24 U4.24 53.94,19.88 53.24,20.57 48.58,20.57 C27.POS | 45.06,13.74 C17.1 44.27,12.37 42.74,10.84 L3.2 | 45.06,13.74 U4.46 | 45.06,13.74 44.86,13.95 v44.86,16 | U4.39 44.99,17.24 v44.7,17.53 | C27.POS 48.05,20.83 C13.1 46.81,20.5 v46.38,20.07 | U4.34 C27.POS
  Bottom 0.203: v44.86,16 44.86,17.37 v44.7,17.53 44.7,18.39 v46.38,20.07
VPHY  (via drill 0.2)
  Top 0.203: U4.3 48.19,9.86 C19.1 48.08,9.65 v47.4,9.65 | v44.86,9.65 44.04,10.47 L3.1
  Bottom 0.203: v47.4,9.65 v44.86,9.65
VPLL
  Top 0.203: U4.8 50.69,10.93 51.71,9.91 C18.1 52.04,9.58 52.48,9.14 53.24,9.14 54,9.91 55.27,9.91 55.64,10.27 L4.1
VUSB  (via drill 0.2)
  Top 0.203: R2.2 59.84,2.87 59.84,7.29
  Top 0.406: J1.1 55.3,5.87
  Top 0.61: U3.1 61.43,8.13 | 61.43,8.13 61.43,7.87 C22.1 59.84,7.29 56.72,7.29 55.3,5.87 55.3,8.1 v54.25,9.14 | U3.3 63.33,8.57 62.89,8.13 62.13,8.13 | 62.13,8.13 61.43,8.13 | C23.1 62.13,8.13 | v41.05,14.22 L5.1
  Bottom 0.61: v54.25,9.14 51.97,11.43 47.14,11.43 44.09,14.22 v41.05,14.22

### Text on the board
tPlace: A | MOSI | SCLK | !RST | GP1 | GP3 | SDA | INT | XTL1 | VCC | GND | TriDev | SYNC | MISO | !CS | GP0 | GP2 | GP4 | SCL | IRQ | GND | nRF | 2015/10/19 | Brad Campbell | CURR | TriPoint | CURR | STM
bPlate: B